# EAGLE design MS5607 Breakout (EAGLE 9.6.2)
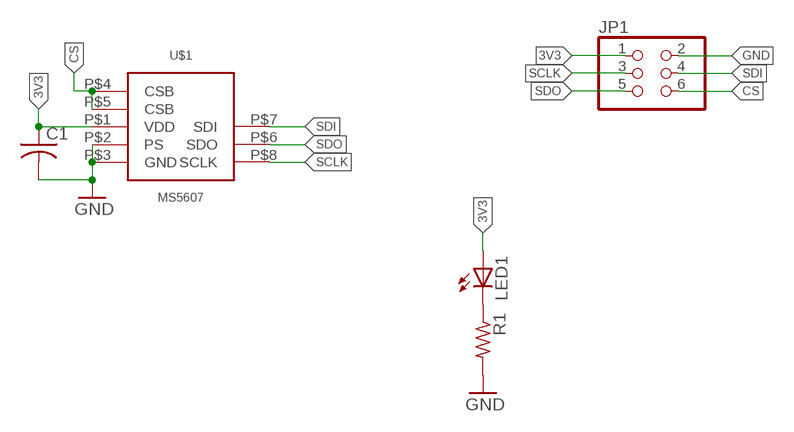
[diagram p0: schematic, sheet 1]

## Parts
C1  C-USC0805  [C0805]
JP1  PINHD-2X3  [2X03]
LED1  LEDCHIPLED_0805  [CHIPLED_0805]
R1  R-US_R0805  [R0805]
U$1  MS5607  [MS5607]

## Nets
3V3: C1.1 JP1.1 LED1.A U$1.P$1(VDD)
CS: JP1.6 U$1.P$4(CSB) U$1.P$5(CSB)
GND: C1.2 JP1.2 R1.2 U$1.P$2(PS) U$1.P$3(GND)
N$1: LED1.C R1.1
SCLK: JP1.3 U$1.P$8(SCLK)
SDI: JP1.4 U$1.P$7(SDI)
SDO: JP1.5 U$1.P$6(SDO)

## Library data of the parts
C1 = resistor:C-US: CAPACITOR, American symbol
JP1 = pinhead:PINHD-2X3: PIN HEADER
LED1 = adafruit:LED: LED OSRAM: - CHIPLED LG R971, LG N971, LY N971, LG Q971, LY Q971, LO R971, LY R971 LH N974, LH R974 LS Q976, LO Q976, LY Q976 LO Q996 - Hyper CHIPLED LW Q18S LB Q993, LB Q99A, LB R99A - SideLED LS A670, LO A670, LY A670, LG A670, LP A670 LB A673, LV A673, LT A673, LW A673 LH A674 LY A675 LS A676, LA A676, LO A676, LY A676, LW A676 LS A679, LY A679, LG A679 - Hyper Micro SIDELED® LS Y876, LA Y876, LO Y876, LY Y876 LT Y87S - SmartLED LW L88C, LW L88S LB L89C, LB L89S, LG L890 LS L89K, LO L89K, LY L89K LS L896, LA L896, LO L896, LY L896 - TOPLED LS T670, LO T670, LY T670, LG T670, LP T670 LSG T670, LSP T670, LSY T670, LOP T670, LYG T670 LG T671, LOG T671, LSG T671 LB T673, LV T673, LT T673, LW T673 LH T674 LS T676, LA T676, LO T676, LY T676, LB T676, LH T676, LSB T676, LW T676 LB T67C, LV T67C, LT T67C, LS T67K, LO T67K, LY T67K, LW E67C LS E67B, LA E67B, LO E67B, LY E67B, LB E67C, LV E67C, LT E67C LW T67C LS T679, LY T679, LG T679 LS T770, LO T770, LY T770, LG T770, LP T770 LB T773, LV T773, LT T773, LW T773 LH T774 LS E675, LA E675, LY E675, LS T675 LS T776, LA T776, LO T776, LY T776, LB T776 LHGB T686 LT T68C, LB T68C - Hyper Mini TOPLED® LB M676 - Mini TOPLED Santana® LG M470 LS M47K, LO M47K, LY M47K Source: http://www.osram.convergy.de/
R1 = resistor:R-US_: RESISTOR, American symbol
U$1 = Computer2:MS5607

## Board
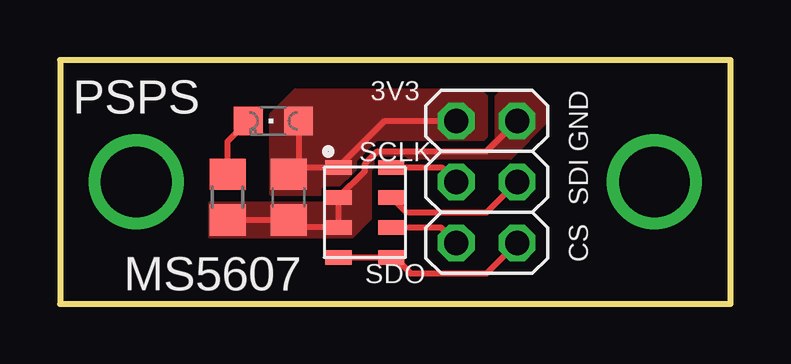
[diagram p1: board, top side]

Size 27.94 x 10.16 mm. Coordinates in mm from the lower left corner, seen from the top.
Outline: 0,0 27.94,0 27.94,10.16 0,10.16 0,0
Copper layers (1*16): Top 0.035mm / dielectric 1.5mm / Bottom 0.035mm
Design rules "default": minimum track width 6mil, minimum drill 0.35mm, track to track 6mil, track to pad 6mil, pad to pad 6mil, via to via 6mil, smd to smd 6mil, copper to edge 40mil, drill to drill 6mil, minimum pad ring 10mil, minimum via ring 8mil, stop-mask expansion 4mil, vias tented up to drill 0mil, thermal gap 10mil

### Footprints (pad centres in the part's own frame; a part is rotated, then mirrored left to right if it is on the bottom)
C0805 = smd 1.3 x 1.5: 1 -0.95,0; 2 0.95,0
2X03 = drill 1.016 octagon: 1 -2.54,-1.27; 2 -2.54,1.27; 3 0,-1.27; 4 0,1.27; 5 2.54,-1.27; 6 2.54,1.27
CHIPLED_0805 = smd 1.2 x 1.2: A 0,-1.05; C 0,1.05
R0805 = smd 1.3 x 1.5: 1 -0.95,0; 2 0.95,0
MS5607 = smd 1.1 x 0.6: P$1 -1.1,1.875; P$2 -1.1,0.625; P$3 -1.1,-0.625; P$4 -1.1,-1.875; P$5 1.1,-1.875; P$6 1.1,-0.625; P$7 1.1,0.625; P$8 1.1,1.875

### Placement (x,y rotation side)
C1  9.52,4.45 270 top
JP1  17.78,5.08 270 top
LED1  8.89,7.62 90 top
R1  6.98,4.45 270 top
U$1  12.7,3.81 0 top

### Tracks (layer width: path | path; a pad name or v marks a point on that pad's centre or on a via)
3V3
  Top 0.254: C1.1 9.81,5.69 | 9.81,5.69 U$1.P$1 13.54,7.62 JP1.1 | LED1.A 9.94,5.81 9.81,5.69
  pour Top (no thermals): 8.76,4.57 11.3,4.57 12.32,5.59 12.32,5.97 13.21,6.86 17.65,6.86 17.78,6.99 17.78,8.64 17.53,8.89 9.78,8.89 8.76,7.87
CS
  Top 0.254: U$1.P$4 U$1.P$5 13.94,1.94 14.6,1.27 17.78,1.27 JP1.6
GND
  Top 0.254: U$1.P$3 11.43,3.19 | 11.43,3.19 9.83,3.19 C1.2 R1.2 | U$1.P$2 11.6,3.35 11.43,3.19 | U$1.P$2 11.8,4.44 | JP1.2 17.78,6.35 13.22,6.35 12.7,5.83 12.7,5.54 U$1.P$2
  pour Top (no thermals): 13.08,6.22 12.7,5.84 12.7,5.46 11.43,4.19 6.22,4.19 6.22,2.79 12.19,2.79 12.95,3.56 12.95,5.59 13.46,6.1 18.8,6.1 20.32,7.62 20.32,8.25 19.68,8.89 18.41,8.89 18.16,8.64 18.16,6.86 17.53,6.22
N$1
  Top 0.254: R1.1 6.98,6.77 LED1.C
N$2  (via drill 2.95)
  other vias: 24.77,5.08
N$3  (via drill 2.95)
  other vias: 3.17,5.08
SCLK
  Top 0.254: U$1.P$8 15.9,5.69 JP1.3
SDI
  Top 0.254: U$1.P$7 14.42,3.81 17.78,3.81 JP1.4
SDO
  Top 0.254: U$1.P$6 15.86,3.19 JP1.5

### Text on the board
tNames: PSPS | 3V3 | GND | SCLK | SDI | CS | MS5607 | SDO
bNames: JLCJLCJLCJLC